# EAGLE design PICmain (EAGLE 9.6.2)
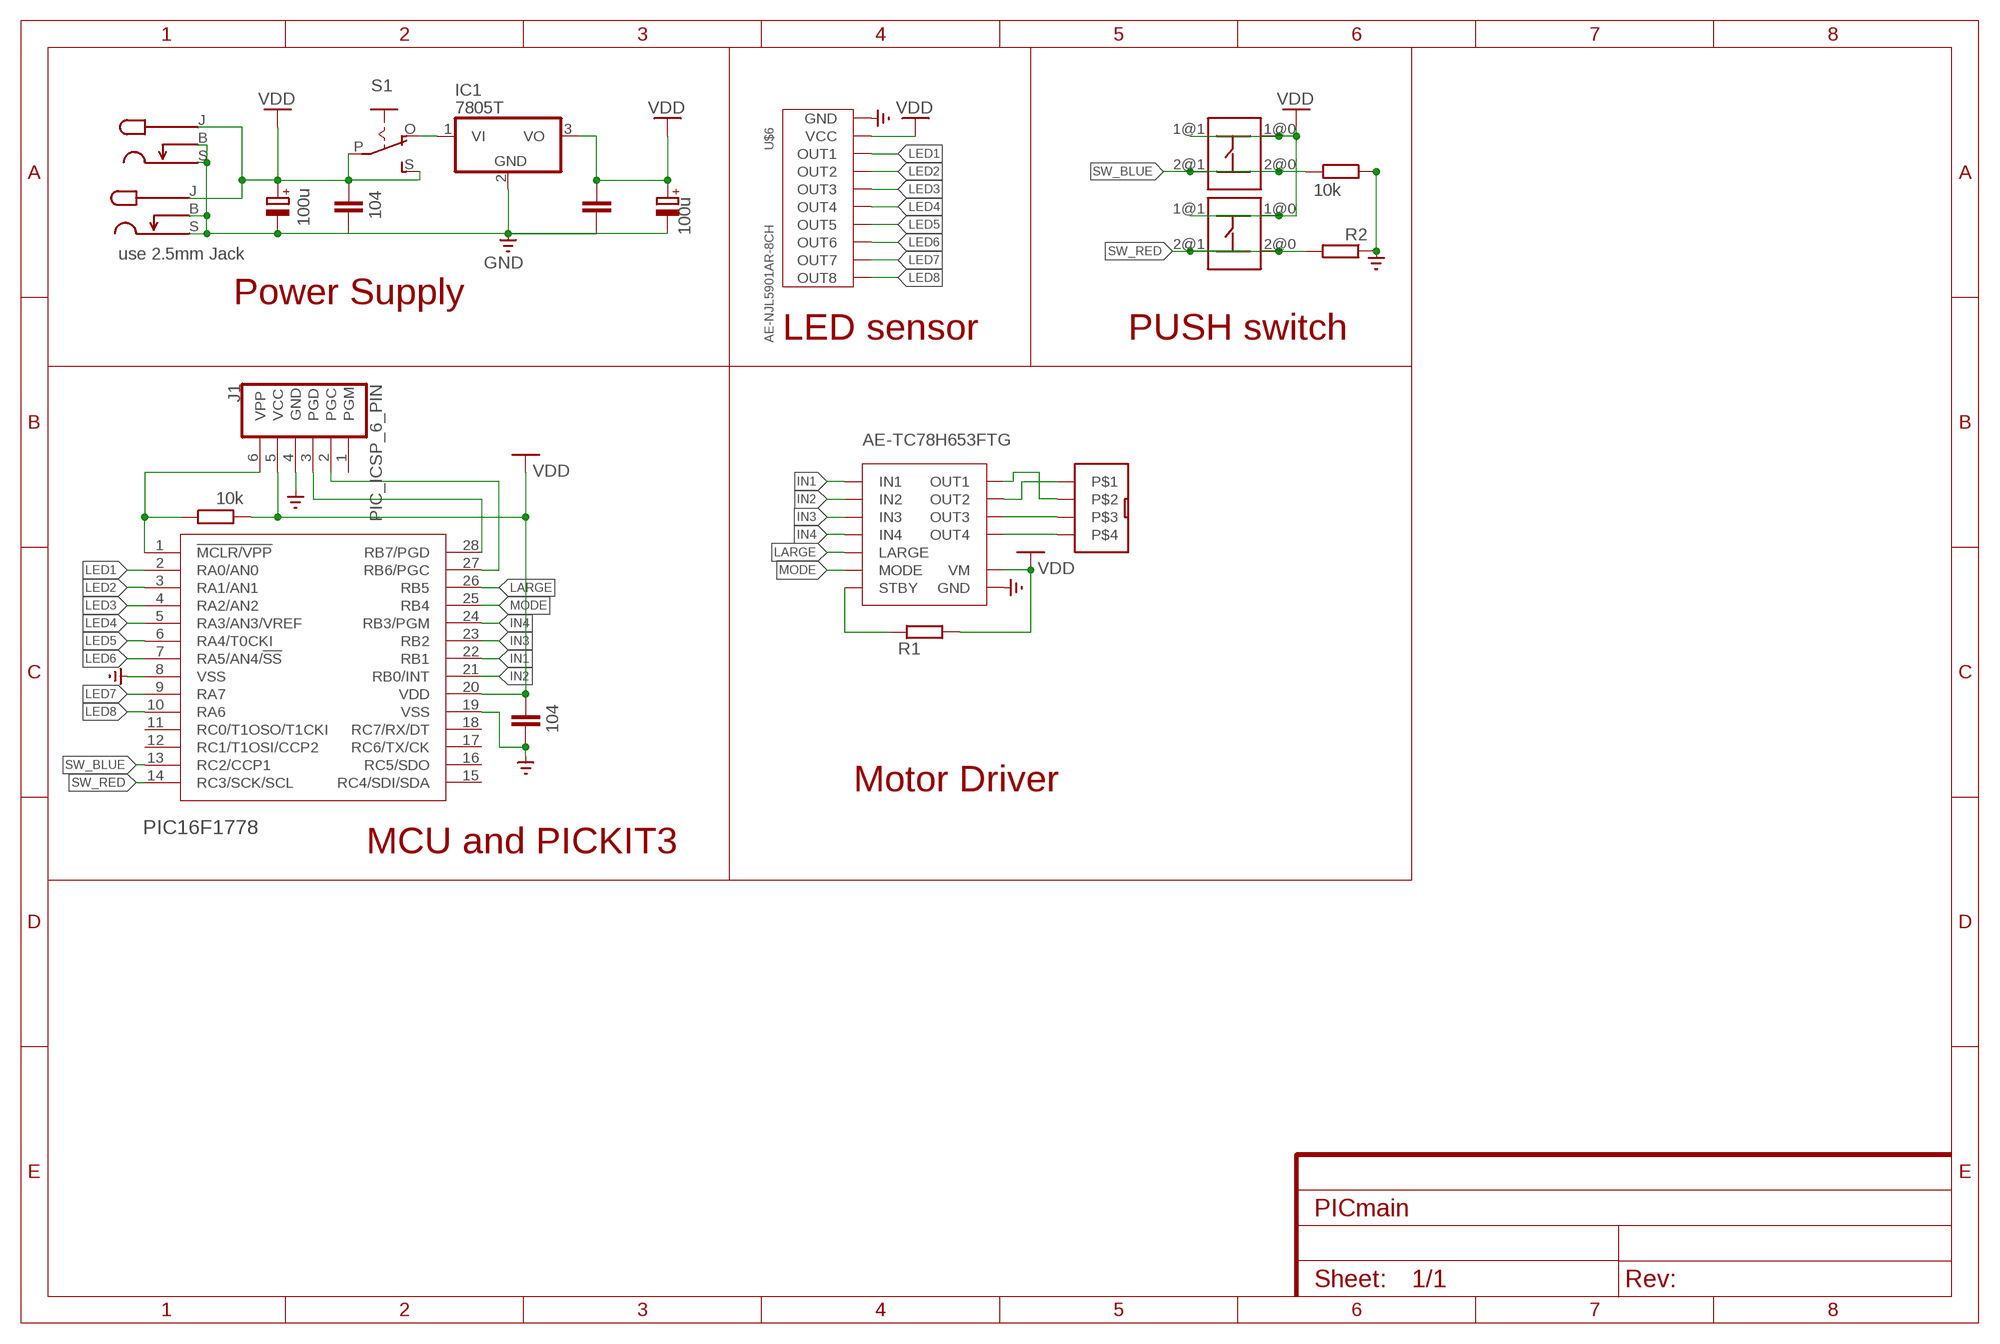
[diagram p0: schematic, sheet 1]

## Parts
C1  100u  CPOL-EUE2.5-6  [E2,5-6]
C2  104  C-EU025-025X050  [C025-025X050]
C3  104  C-EU025-025X050  [C025-025X050]
C4  100u  CPOL-EUE2.5-6  [E2,5-6]
C5  104  C-EU025-025X050  [C025-025X050]
CONNECTOR1  TACT_SWITCH  [TACT_SWITCH]
CONNECTOR2  TACT_SWITCH  [TACT_SWITCH]
IC1  7805T  [TO220H]
J1  PIC_ICSP_6_PIN  [MOLEX-1X6]
R1  R-EU_0204/7  [0204/7]
R2  R-EU_0204/7  [0204/7]
R3  10k  R-EU_0204/7  [0204/7]
R4  10k  R-EU_0204/7  [0204/7]
S1  EG1218S  [EG1218]
U1  PIC16F1778  [DIL28-3]
U$1  MJ-179PH  [MJ-179PH]
U$2  4PIN  [4PIN]
U$3  AE-TC78H653FTG  [AE-TC78H653FTG]
U$5  MJ-179PH  [MJ-179PH]
U$6  AE-NJL5901AR-8CH  [AE-NJL5901AR-8CH]

## Nets
GND: C1.- C2.2 C3.2 C4.- C5.2 IC1.2(GND) J1.4(GND) R2.1 R4.1 U1.8(VSS) U1.19(VSS) U$1.B U$1.S U$3.GND@0(GND) U$3.GND@1(GND) U$3.GND@2(GND) U$5.B U$5.S U$6.GND
IN1: U1.22(RB1) U$3.IN1
IN2: U1.21(RB0/INT) U$3.IN2
IN3: U1.23(RB2) U$3.IN3
IN4: U1.24(RB3/PGM) U$3.IN4
LARGE: U1.26(RB5) U$3.LARGE
LED1: U1.2(RA0/AN0) U$6.OUT1
LED2: U1.3(RA1/AN1) U$6.OUT2
LED3: U1.4(RA2/AN2) U$6.OUT3
LED4: U1.5(RA3/AN3/VREF) U$6.OUT4
LED5: U1.6(RA4/T0CKI) U$6.OUT5
LED6: U1.7(RA5/AN4/!SS) U$6.OUT6
LED7: U1.9(RA7) U$6.OUT7
LED8: U1.10(RA6) U$6.OUT8
MDVDD: C1.+ C2.1 R1.2 S1.P S1.S U$1.J(L) U$3.VM@0(VM) U$3.VM@1(VM) U$5.J(L) ; supply symbol labelled VDD
MODE: U1.25(RB4) U$3.MODE
OUT1: U$2.P$2 U$3.OUT1
OUT2: U$2.P$1 U$3.OUT2
OUT3: U$2.P$3 U$3.OUT3
OUT4: U$2.P$4 U$3.OUT4
PGC: J1.2(PGC) U1.27(RB6/PGC)
PGD: J1.3(PGD) U1.28(RB7/PGD)
STBY: R1.1 U$3.STBY
SW_BLUE: CONNECTOR1.2@0 CONNECTOR1.2@1 R4.2 U1.13(RC2/CCP1)
SW_RED: CONNECTOR2.2@0 CONNECTOR2.2@1 R2.2 U1.14(RC3/SCK/SCL)
VDD: C3.1 C4.+ C5.1 CONNECTOR1.1@0 CONNECTOR1.1@1 CONNECTOR2.1@0 CONNECTOR2.1@1 IC1.3(VO) J1.5(VCC) R3.2 U1.20(VDD) U$6.VIN(VCC)
VI: IC1.1(VI) S1.O
VPP: J1.6(VPP) R3.1 U1.1(!MCLR/VPP)
Unconnected: J1.1(PGM) U1.11(RC0/T1OSO/T1CKI) U1.12(RC1/T1OSI/CCP2) U1.15(RC4/SDI/SDA) U1.16(RC5/SDO) U1.17(RC6/TX/CK) U1.18(RC7/RX/DT)

## Notes on the sheet
- use 2.5mm Jack
- Power Supply
- LED sensor | PUSH switch
- Motor Driver
- MCU and PICKIT3

## Library data of the parts
C1 C4 = rcl:CPOL-EU: POLARIZED CAPACITOR, European symbol; SPICEPREFIX: C
C2 C3 C5 = rcl:C-EU: CAPACITOR, European symbol; SPICEPREFIX: C
CONNECTOR1 CONNECTOR2 = akizuki:TACT_SWITCH: akizuki tact switch
IC1 = linear:78*: Positive VOLTAGE REGULATOR Source: http://cache.national.com/ds/LM/LM78L05.pdf http://www.fairchildsemi.com/ds/LM/LM7805.pdf
J1 = SparkFun-Connectors:PIC_ICSP_6_PIN: ISCP Programming connector for PICs This 6 pin header contains all the lines necessary for programming most PIC microcontrollers. Here is the connector we sell at SparkFun: Polarized Connectors - Header (6-Pin) <https://www.sparkfun.com/products/8094> (PRT-08094) It is used on this SparkFun product: SparkFun UDB5 - PIC UAV Development Board <https://www.sparkfun.com/products/11703> (DEV-11703) Also, if you need a nice PIC programmer, please check these out: MPLAB PICkit 3 <https://www.sparkfun.com/products/9973> (PGM-09973); PROD_ID: CONN-08046; SF_ID: PRT-08094
R1-R4 = rcl:R-EU_: RESISTOR, European symbol; SPICEPREFIX: R
S1 = adafruit:EG1218: SLIDING SWITCH 0.1" spacing through hole, vertical SPDT slide switch http://www.ladyada.net/library/pcb/eaglelibrary.html
U1 = microchip:PIC16F1778
U$1 U$5 = akizuki:MJ-179PH
U$2 = con-ei:4PIN
U$3 = akizuki:AE-TC78H653FTG
U$6 = akizuki:AE-NJL5901AR-8CH

## Board
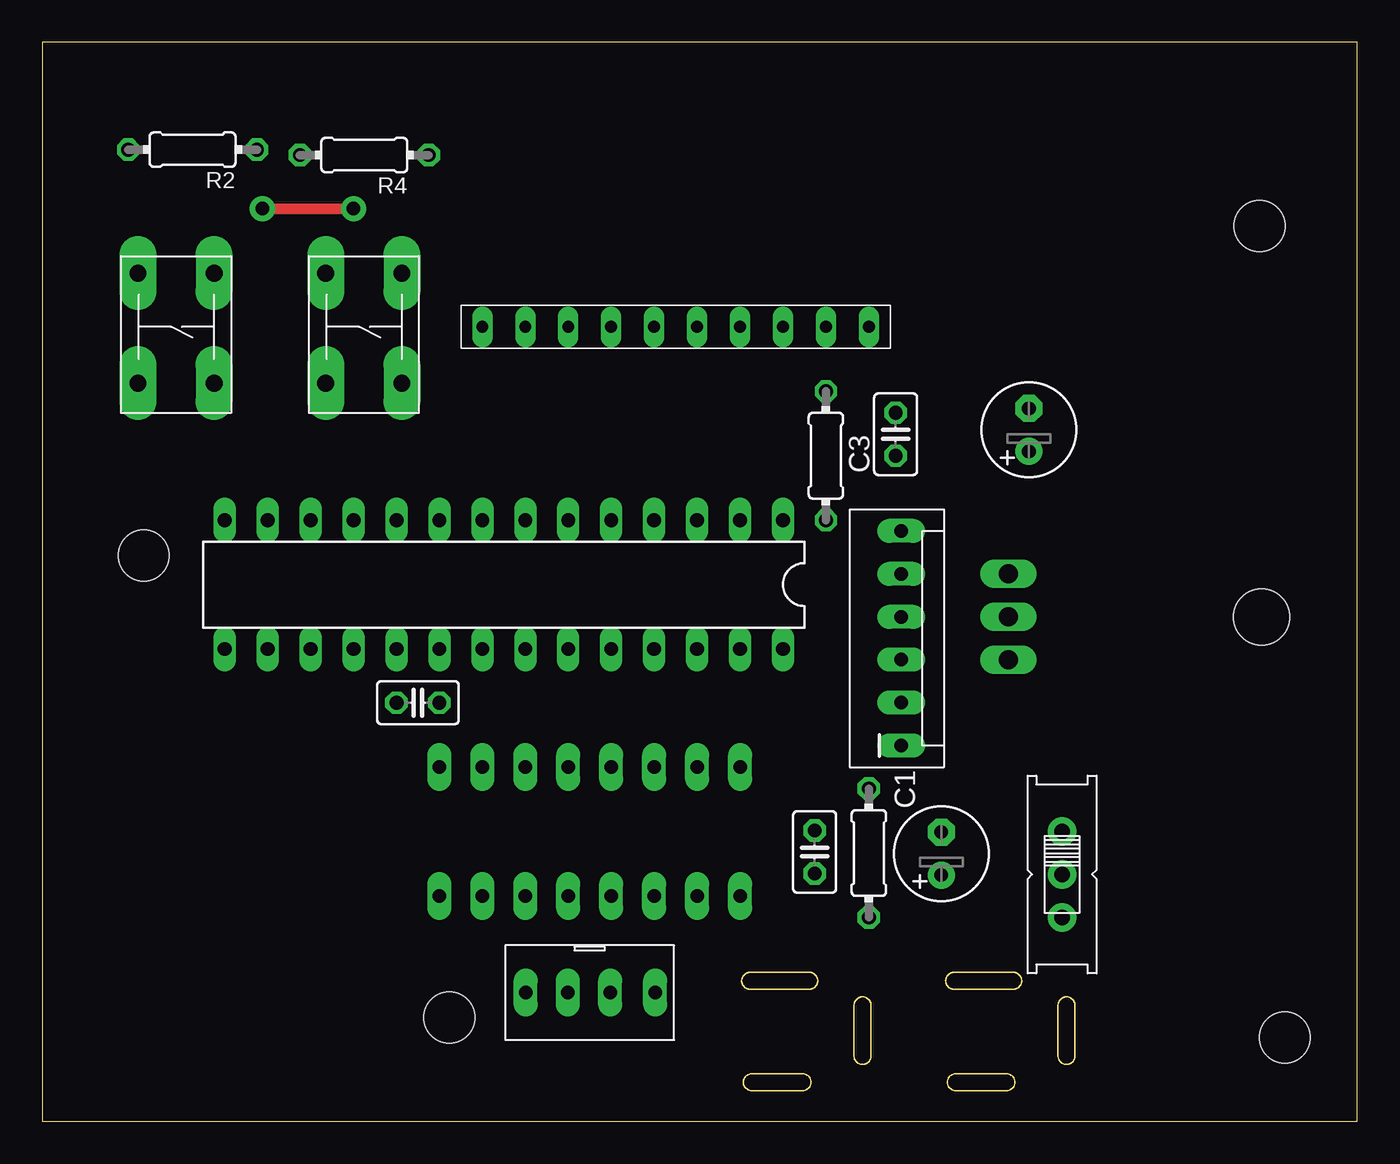
[diagram p1: board, top side]
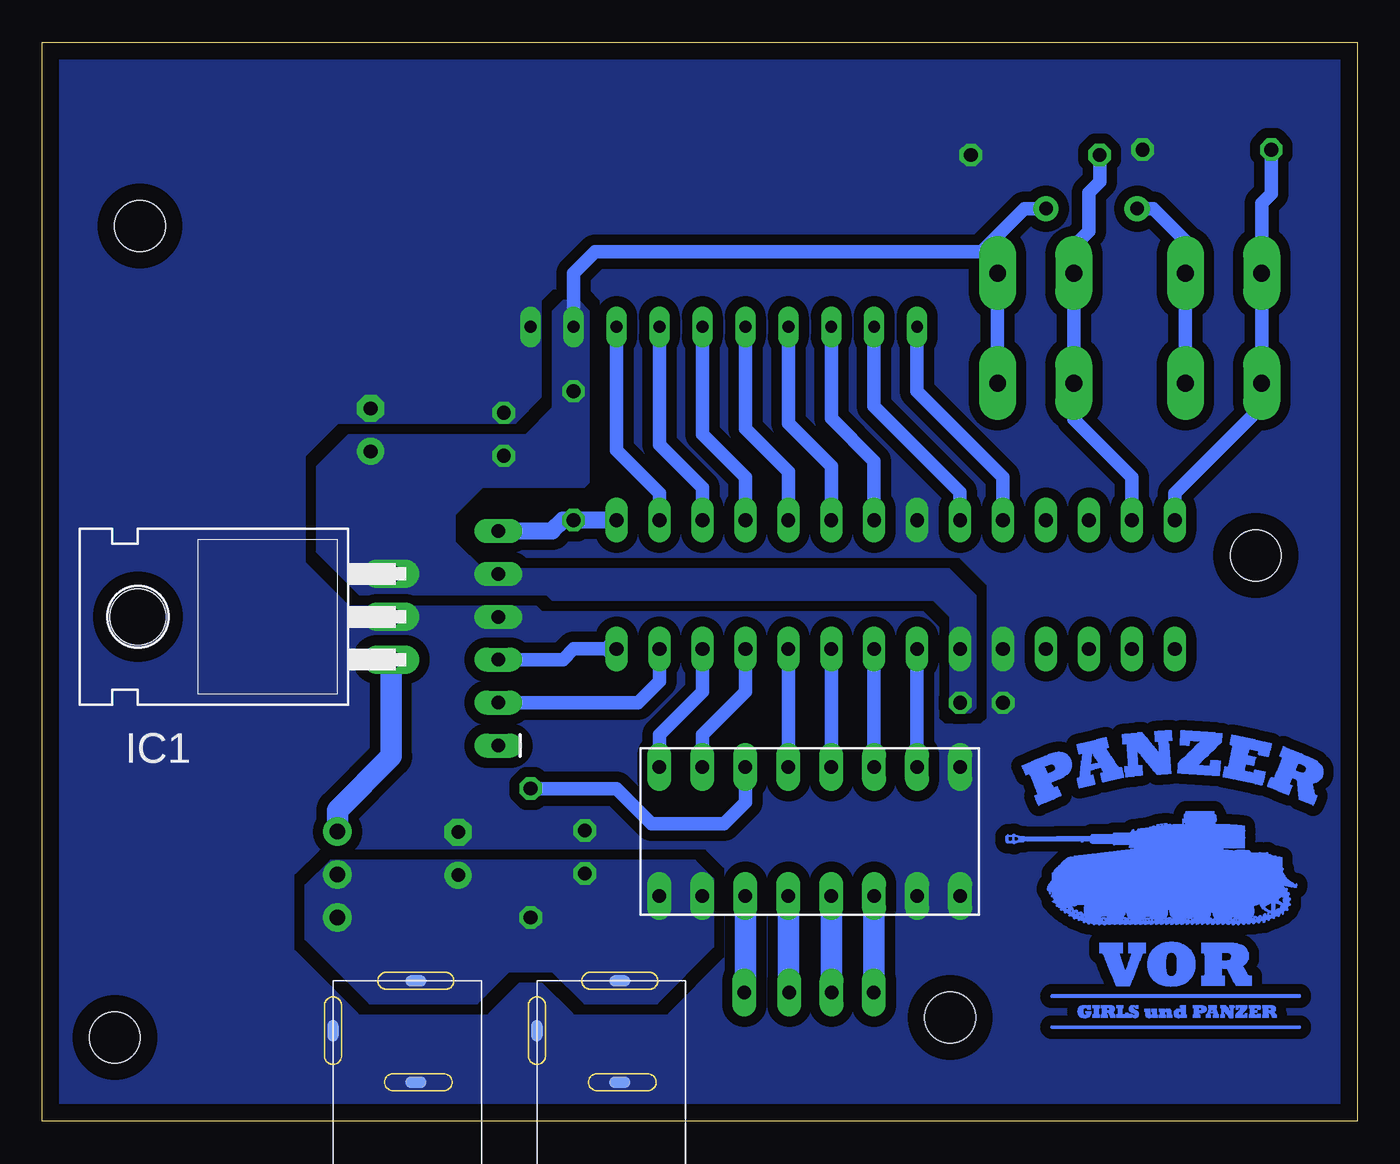
[diagram p2: board, bottom side, seen from below]

Size 77.79 x 63.82 mm. Coordinates in mm from the lower left corner, seen from the top.
Outline: 0,0 77.79,0 77.79,63.82 0,63.82 0,0
Copper layers (1*16): Top 0.035mm / dielectric 1.5mm / Bottom 0.035mm
Design rules "default *": minimum track width 24mil, minimum drill 0.8mm, track to track 0.5mm, track to pad 0.5mm, pad to pad 0.5mm, via to via 0.5mm, smd to smd 6mil, copper to edge 1mm, drill to drill 6mil, minimum pad ring 10mil, minimum via ring 8mil, stop-mask expansion 4mil, vias tented up to drill 0mil, thermal gap 10mil
Holes 3 mm at 24.09,6.14 73.5,4.96 72,52.96 6,33.46

### Footprints (pad centres in the part's own frame; a part is rotated, then mirrored left to right if it is on the bottom)
E2,5-6 = drill 0.813 pad 1.6: + -1.27,0 | drill 0.813 pad 1.6 octagon: - 1.27,0
C025-025X050 = drill 0.813 octagon: 1 -1.27,0; 2 1.27,0
TACT_SWITCH = drill 1 pad 2.184 long: 1@0 -2.54,-2.54; 1@1 -2.54,3.96; 2@0 1.96,-2.54; 2@1 1.96,3.96
TO220H = drill 1.118 long: 1 -2.54,-10.16; 2 0,-10.16; 3 2.54,-10.16 | hole 3.302: 0,4.826
MOLEX-1X6 = drill 0.8 pad 1.422 long: 1 0,0; 2 2.54,0; 3 5.08,0; 4 7.62,0; 5 10.16,0; 6 12.7,0
0204/7 = drill 0.813 octagon: 1 -3.81,0; 2 3.81,0
EG1218 = drill 0.9 pad 1.676: O -2.54,0; P 0,0; S 2.54,0
DIL28-3 = drill 0.813 long: 1 -16.51,-3.81; 2 -13.97,-3.81; 3 -11.43,-3.81; 4 -8.89,-3.81; 5 -6.35,-3.81; 6 -3.81,-3.81; 7 -1.27,-3.81; 8 1.27,-3.81; 9 3.81,-3.81; 10 6.35,-3.81; 11 8.89,-3.81; 12 11.43,-3.81; 13 13.97,-3.81; 14 16.51,-3.81; 15 16.51,3.81; 16 13.97,3.81; 17 11.43,3.81; 18 8.89,3.81; 19 6.35,3.81; 20 3.81,3.81; 21 1.27,3.81; 22 -1.27,3.81; 23 -3.81,3.81; 24 -6.35,3.81; 25 -8.89,3.81; 26 -11.43,3.81; 27 -13.97,3.81; 28 -16.51,3.81
MJ-179PH = smd 1.27 x 0.66 bottom: B 0,0 | smd 0.66 x 1.27 bottom: J 2.95,4.9; S -3.05,4.9
4PIN = drill 0.8 pad 1.422 long: P$1 -3.79,0; P$2 -1.29,0; P$3 1.21,0; P$4 3.87,0
AE-TC78H653FTG = drill 0.8 pad 1.422 long: GND@0 3.81,-6.35; GND@1 3.81,-8.89; GND@2 -3.81,-8.89; IN1 -3.81,-3.81; IN2 -3.81,-6.35; IN3 -3.81,-1.27; IN4 -3.81,1.27; LARGE -3.81,8.89; MODE -3.81,6.35; OUT1 3.81,-1.27; OUT2 3.81,-3.81; OUT3 3.81,1.27; OUT4 3.81,3.81; STBY -3.81,3.81; VM@0 3.81,8.89; VM@1 3.81,6.35
AE-NJL5901AR-8CH = drill 0.7 pad 1.016 long: GND -11.43,0; OUT1 -6.35,0; OUT2 -3.81,0; OUT3 -1.27,0; OUT4 1.27,0; OUT5 3.81,0; OUT6 6.35,0; OUT7 8.89,0; OUT8 11.43,0; VIN -8.89,0

### Placement (x,y rotation side)
C1  53.18,15.84 90 top
C2  45.69,15.94 90 top
C3  50.48,40.64 90 top
C4  58.36,40.89 90 top
C5  22.23,24.77 180 top
CONNECTOR1  18.73,47.62 180 top
CONNECTOR2  7.62,47.62 180 top
IC1  67.31,29.84 90 bottom
J1  50.8,22.23 90 top
R1  48.9,15.88 270 top
R2  8.89,57.47 180 top
R3  46.35,39.37 90 top
R4  19.05,57.15 180 top
S1  60.33,14.61 270 top
U1  27.3,31.75 180 top
U$1  48.52,5.37 90 top
U$2  32.38,7.62 0 top
U$3  32.38,17.14 270 top
U$5  60.59,5.37 90 top
U$6  37.47,46.99 180 top

### Tracks (layer width: path | path; a pad name or v marks a point on that pad's centre or on a via)
GND
  pour Bottom (isolate 0.61, rank 6, no thermals): 77.79,63.82 0,63.82 0,0 78.11,0 78.11,63.82
IN1
  Bottom 0.813: U$3.IN1 U1.22
IN2
  Bottom 0.813: U$3.IN2 U1.21
IN3
  Bottom 0.813: U$3.IN3 U1.23
IN4
  Bottom 0.813: U$3.IN4 U1.24
LARGE
  Bottom 0.813: U$3.LARGE 41.27,22.86 38.73,25.4 U1.26
LED1
  Bottom 0.813: U$6.OUT1 43.81,39.69 41.27,37.15 U1.2
LED2
  Bottom 0.813: U$6.OUT2 41.27,40.01 38.73,37.47 U1.3
LED3
  Bottom 0.813: U$6.OUT3 38.73,40.64 36.2,38.1 U1.4
LED4
  Bottom 0.813: U$6.OUT4 36.2,40.96 33.66,38.42 U1.5
LED5
  Bottom 0.813: U$6.OUT5 33.66,41.27 31.11,38.73 U1.6
LED6
  Bottom 0.813: U$6.OUT6 31.11,41.59 28.57,39.05 U1.7
LED7
  Bottom 0.813: U1.9 23.5,37.21 28.57,42.29 U$6.OUT7 28.57,47.62
LED8
  Bottom 0.813: U1.10 20.95,38.1 26.04,43.18 U$6.OUT8
MDVDD
  pour Bottom (no thermals): 38.1,14.35 39.18,15.43 60.74,15.43 62.2,13.97 62.2,10.76 58.42,6.99 52.07,6.99 50.16,8.89 47.62,8.89 45.72,6.99 41.43,6.99 38.1,10.32
MODE
  Bottom 0.813: U1.25 36.2,25.4 38.73,22.86 U$3.MODE
OUT1
  Bottom 1.27: U$2.P$2 31.09,8.22 31.11,8.24 U$3.OUT1
OUT2
  Bottom 1.27: U$2.P$1 28.59,8.22 28.57,8.24 U$3.OUT2
OUT3
  Bottom 1.27: U$2.P$3 33.59,8.22 33.66,8.28 U$3.OUT3
OUT4
  Bottom 1.27: U$2.P$4 36.26,8.22 36.2,8.28 U$3.OUT4
PGC
  Bottom 0.813: U1.27 41.27,26.04 42.55,24.77 J1.2
PGD
  Bottom 0.813: U1.28 44.45,27.94 | 44.45,27.94 46.35,27.94 46.99,27.3 J1.3 | U1.28 43.81,27.3 44.45,27.94 | 44.45,27.94 43.81,28.57 U1.28
STBY
  Bottom 0.813: U$3.STBY 36.2,18.88 37.47,17.61 41.74,17.61 43.81,19.68 R1.1
SW_BLUE
  Bottom 0.813: U1.13 13.34,38.1 16.77,41.54 CONNECTOR1.2@1 CONNECTOR1.2@0 16.77,51.75 15.88,52.65 15.88,54.93 15.24,55.56 R4.2
SW_RED
  Bottom 0.61: 5.66,42.28 CONNECTOR2.2@1
  Bottom 0.813: R2.2 5.08,54.87 5.66,54.29 CONNECTOR2.2@0 CONNECTOR2.2@1 | 5.66,42.28 10.79,37.15 U1.14
VDD  (via drill 0.8 pad 1.5)
  Top 0.61: v18.41,53.98 v13.02,53.98
  Bottom 0.813: 46.35,48.26 U$6.VIN 46.35,50.16 45.09,51.44 22.23,51.44 | CONNECTOR1.1@0 CONNECTOR1.1@1 | CONNECTOR2.1@1 CONNECTOR2.1@0 10.16,52.07 12.06,53.98 v13.02,53.98 | 22.23,51.44 21.91,51.44 | v18.41,53.98 19.68,53.98 21.27,52.39 | CONNECTOR1.1@0 21.27,50.8 21.91,51.44 | CONNECTOR1.1@0 21.27,51.44 | 21.27,51.44 21.27,52.39 | 21.91,51.44 21.27,51.44 | 22.23,51.44 21.27,52.39
  pour Bottom (rank 5, no thermals): 61.59,33.66 61.59,38.73 59.69,40.64 49.21,40.64 47.62,42.23 47.62,47.94 46.99,48.58 46.04,48.58 45.4,47.94 45.4,37.78 45.72,37.47 51.75,37.47 53.34,35.88 53.34,34.29 51.75,32.7 24.13,32.7 22.54,31.11 22.54,24.45 22.86,24.13 23.81,24.13 24.13,24.45 24.13,29.84 25.08,30.8 47.62,30.8 47.94,31.11 59.05,31.11
VI
  Bottom 1.27: IC1.1 57.15,21.59 60.33,18.41 S1.O
VPP
  Bottom 1.016: J1.6 47.62,34.92 46.99,35.56 R3.1 U1.1
(copper drawn outside any net)
  shapes: Bottom area x2316